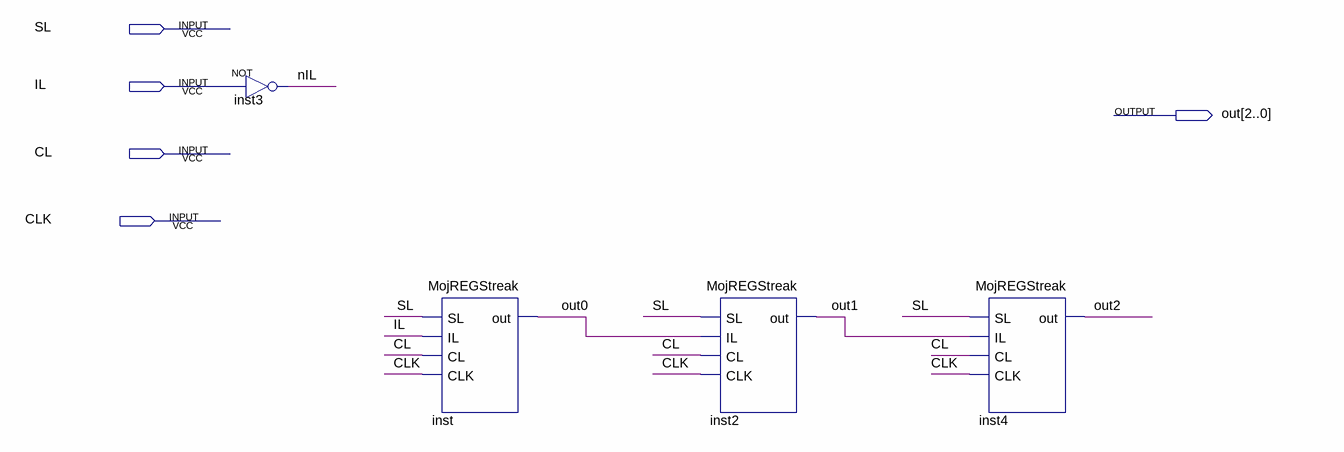
[diagram p0: schematic sheet]
// Quartus schematic MojeREG3Streak.bdf as structural Verilog: 4 symbols, 5 pins
module MojeREG3Streak (
  input  SL,
  input  IL,
  input  CL,
  input  CLK,
  output [2:0] out
);

  wire nIL;

  not inst3 (nIL, IL);
  MojREGStreak inst (.SL(SL), .IL(IL), .CL(CL), .CLK(CLK), .out(out[0]));
  MojREGStreak inst2 (.SL(SL), .IL(out[0]), .CL(CL), .CLK(CLK), .out(out[1]));
  MojREGStreak inst4 (.SL(SL), .IL(out[1]), .CL(CL), .CLK(CLK), .out(out[2]));
endmodule
